# Altium schematic sheet 5v to 3.3V LDO.SchDoc
size A; SheetNumber: 17; SheetTotal: 31
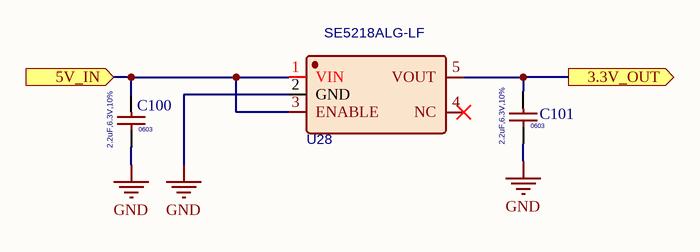
[diagram p0: 5v to 3.3V LDO.SchDoc]

## Parts
C100  Package: 0603  [C0603]  (hidden comment: 2.2uF,6.3V,10%)
C101  Package: 0603  [C0603]  (hidden comment: 2.2uF,6.3V,10%)
U28  SE5218ALG-LF  [SOT-23-5]

## Ports
3.3V_OUT (out), 5V_IN (in)

## Nets
GND: C100.2 C101.2 U28.2(GND)
3.3V_OUT: C101.1 U28.5(VOUT) ; port 3.3V_OUT
5V_IN: C100.1 U28.1(VIN) U28.3(ENABLE) ; port 5V_IN

Not connected (* = marked no-connect by the designer): U28 4(NC)*

## Library data of the parts
C100 C101 = CGA3E1X7R0J225K080AC: CAP CER 2.2UF 6.3V X7R 0603; Manufacturer: TDK Corporation; Type: SM; Min Operating Temp: -55°C; Max Operating Temp: 125°C; MPN: CGA3E1X7R0J225K080AC; Datasheet: https://product.tdk.com/system/files/dam/doc/product/capacitor/ceramic/mlcc/catalog/mlcc_automotive_general_en.pdf; Value: 2.2uF,6.3V,10%
U28 = SE5218ALG-LF: 75dB 500mA Adjustable 3.3V Positive electrode 5V SOT-23-5 Voltage Regulators - Linear, Low Drop Out (LDO) Regulators ROHS; Manufacturer: SEAWARD(思旺); MPN: SE5218ALG-LF; LCSC: C118233; Datasheet: https://www.lcsc.com/datasheet/lcsc_datasheet_2304140030_Seaward-Elec-SE5218ALG-LF_C118233.pdf; Package: SOT-23-5